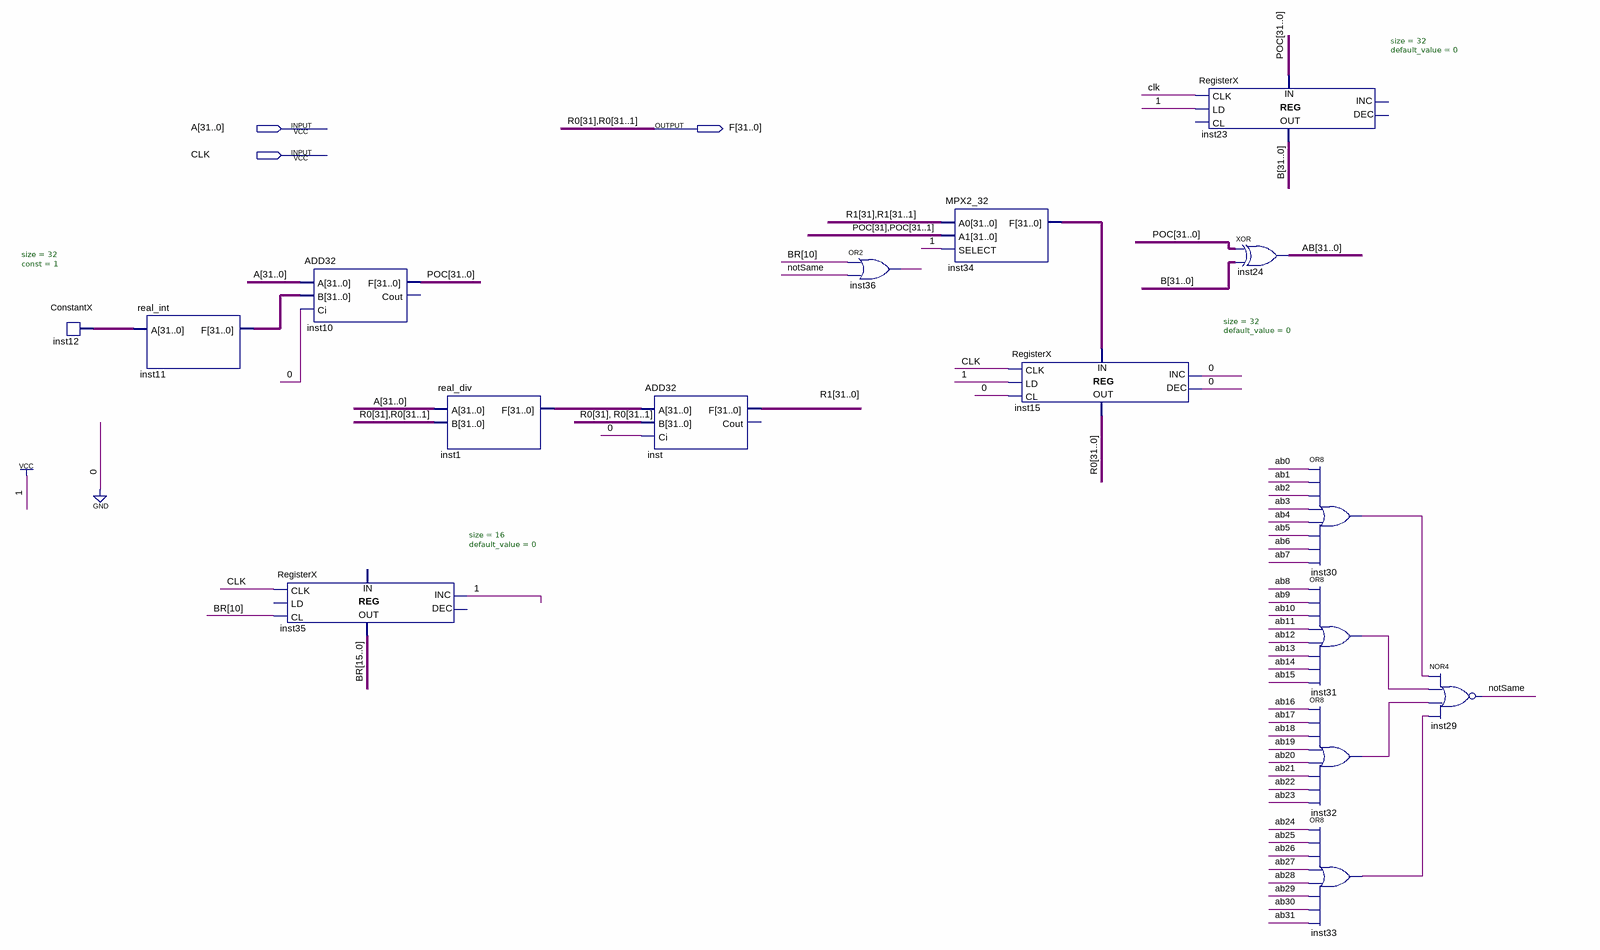
[diagram p0: schematic sheet]
// Quartus schematic real_sqrt.bdf as structural Verilog: 16 symbols, 3 pins
module real_sqrt (
  input  [31:0] A,
  input  CLK,
  output [31:0] F
);

  wire inst30_out, inst31_out, inst32_out, inst33_out, inst36_out, notSame;
  wire [0:0] R0;
  wire [15:0] BR;
  wire [31:0] AB, B, inst1_f, inst11_f, inst12_data_out, inst34_f, POC, R1;

  ConstantX #(.size(32), .\const (1)) inst12 (.DATA_OUT(inst12_data_out));
  real_int inst11 (.A(inst12_data_out), .F(inst11_f));
  RegisterX #(.size(16), .default_value(0)) inst35 (
    .CLK(CLK), .CL(BR[10]), .INC(1'b1), .DATA_OUT(BR));  // open: LD, DEC, DATA_IN
  ADD32 inst10 (.A(A), .B(inst11_f), .Ci(1'b0), .F(POC));  // open: Cout
  real_div inst1 (.A(A), .B({{2{F[31]}}, F[29:0]}), .F(inst1_f));
  ADD32 inst (.A(inst1_f), .B({{2{F[31]}}, F[29:0]}), .Ci(1'b0), .F(R1));  // open: Cout
  or inst36 (inst36_out, BR[10], notSame);
  MPX2_32 inst34 (.A0({{2{R1[31]}}, R1[30:1]}), .A1({{2{POC[31]}}, POC[30:1]}), .SELECT(1'b1), .F(inst34_f));
  RegisterX #(.size(32), .default_value(0)) inst15 (
    .CLK(CLK), .LD(1'b1), .CL(1'b0), .INC(1'b0), .DEC(1'b0), .DATA_IN(inst34_f),
    .DATA_OUT({F[31], F[29:0], R0[0]}));
  RegisterX #(.size(32), .default_value(0)) inst23 (
    .CLK(CLK), .LD(1'b1), .DATA_IN(POC), .DATA_OUT(B));  // open: CL, INC, DEC
  assign AB = POC ^ B;  // XOR inst24, 32 bits wide
  or inst30 (inst30_out, AB[0], AB[1], AB[2], AB[3], AB[4], AB[5], AB[6], AB[7]);
  or inst31 (inst31_out, AB[8], AB[9], AB[10], AB[11], AB[12], AB[13], AB[14], AB[15]);
  or inst32 (inst32_out, AB[16], AB[17], AB[18], AB[19], AB[20], AB[21], AB[22], AB[23]);
  or inst33 (inst33_out, AB[24], AB[25], AB[26], AB[27], AB[28], AB[29], AB[30], AB[31]);
  nor inst29 (notSame, inst30_out, inst31_out, inst32_out, inst33_out);

  assign F[30] = F[31];

  // Other names for the same wires on the sheet: R0[31:1] = {F[31], F[29:0]}
endmodule
